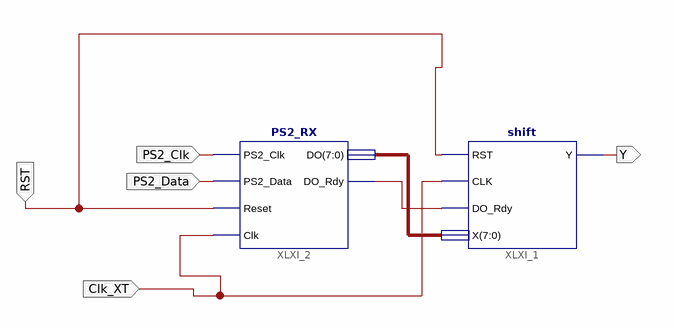
[diagram p0: schematic sheet 1]
// Xilinx ISE schematic shiftsch.sch (xc9500xl) as structural Verilog: 2 symbols, 5 ports
module shiftsch (
  input  Clk_XT,
  input  PS2_Clk,
  input  PS2_Data,
  input  RST,
  output Y
);

  wire XLXN_2;
  wire [7:0] XLXN_1;

  shift XLXI_1 (.RST(RST), .CLK(Clk_XT), .DO_Rdy(XLXN_2), .X(XLXN_1), .Y(Y));
  PS2_RX XLXI_2 (.PS2_Clk(PS2_Clk), .PS2_Data(PS2_Data), .Clk(Clk_XT), .Reset(RST), .DO_Rdy(XLXN_2), .DO(XLXN_1));
endmodule
